# Altium schematic sheet Top.SchDoc
size A4; Organization: TESLA Motors, INC; Address1: 3500 Deer Creek Road; Address2: Palo Alto, CA; Address4: U.S.A.; SheetNumber: 1; SheetTotal: 4
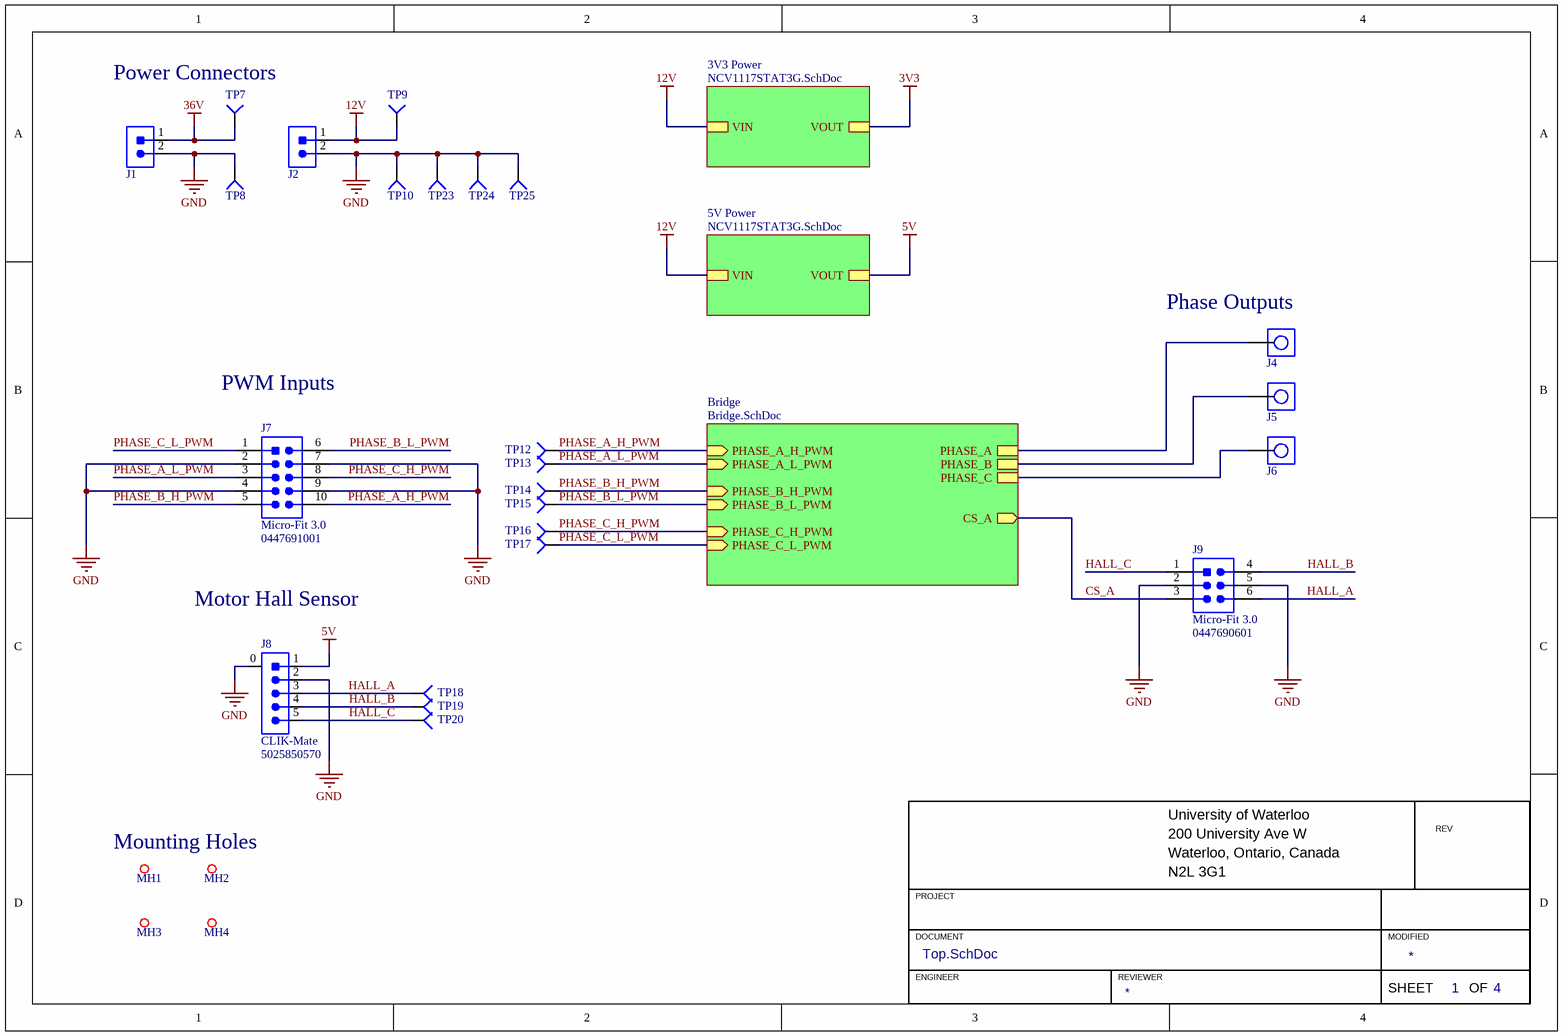
[diagram p0: Top.SchDoc]

## Parts
J1  CON_2POS_XT90  [XT90]  (value not drawn)
J2  CON_2POS_XT60  [XT60]  (value not drawn)
J4  CT3151SP-4  [CALTEST_BANANA_JACK_YELLOW]  (value not drawn)
J5  CT3151SP-5  [CALTEST_BANANA_JACK_GREEN]  (value not drawn)
J6  CT3151SP-6  [CALTEST_BANANA_JACK_BLUE]  (value not drawn)
J7  Family: Micro-Fit 3.0  [MOLEX-0447691001]  (hidden comment: 0447691001)
J8  Family: CLIK-Mate  Manufacturer Part Number 1: 5025850570  [MOLEX-5025850570]  (hidden comment: CON_5M_SM_RA)
J9  Family: Micro-Fit 3.0  [MOLEX-0447690601]  (hidden comment: 0447690601)
MH1  MOUNTING_HOLE_M3  [MOUNTING_HOLE_3mm]  (value not drawn)  (no BOM)
MH2  MOUNTING_HOLE_M3  [MOUNTING_HOLE_3mm]  (value not drawn)  (no BOM)
MH3  MOUNTING_HOLE_M3  [MOUNTING_HOLE_3mm]  (value not drawn)  (no BOM)
MH4  MOUNTING_HOLE_M3  [MOUNTING_HOLE_3mm]  (value not drawn)  (no BOM)
TP7  TESTPOINT_SMD_LOOP  [S1751-46R]  (value not drawn)
TP8  TESTPOINT_SMD_LOOP  [S1751-46R]  (value not drawn)
TP9  TESTPOINT_SMD_LOOP  [S1751-46R]  (value not drawn)
TP10  TESTPOINT_SMD_LOOP  [S1751-46R]  (value not drawn)
TP12  TESTPOINT_1MM_CIRCLE  [TESTPOINT_CIRCLE_1MM]  (value not drawn)  (no BOM)
TP13  TESTPOINT_1MM_CIRCLE  [TESTPOINT_CIRCLE_1MM]  (value not drawn)  (no BOM)
TP14  TESTPOINT_1MM_CIRCLE  [TESTPOINT_CIRCLE_1MM]  (value not drawn)  (no BOM)
TP15  TESTPOINT_1MM_CIRCLE  [TESTPOINT_CIRCLE_1MM]  (value not drawn)  (no BOM)
TP16  TESTPOINT_1MM_CIRCLE  [TESTPOINT_CIRCLE_1MM]  (value not drawn)  (no BOM)
TP17  TESTPOINT_1MM_CIRCLE  [TESTPOINT_CIRCLE_1MM]  (value not drawn)  (no BOM)
TP18  TESTPOINT_1MM_CIRCLE  [TESTPOINT_CIRCLE_1MM]  (value not drawn)  (no BOM)
TP19  TESTPOINT_1MM_CIRCLE  [TESTPOINT_CIRCLE_1MM]  (value not drawn)  (no BOM)
TP20  TESTPOINT_1MM_CIRCLE  [TESTPOINT_CIRCLE_1MM]  (value not drawn)  (no BOM)
TP23  TESTPOINT_SMD_LOOP  [S1751-46R]  (value not drawn)
TP24  TESTPOINT_SMD_LOOP  [S1751-46R]  (value not drawn)
TP25  TESTPOINT_SMD_LOOP  [S1751-46R]  (value not drawn)

## Sub-sheets
3V3 Power = NCV1117STAT3G.SchDoc: VIN, VOUT
5V Power = NCV1117STAT3G.SchDoc: VIN, VOUT
Bridge = Bridge.SchDoc: PHASE_A_H_PWM (in), PHASE_A_L_PWM (in), PHASE_B_H_PWM (in), PHASE_B_L_PWM (in), PHASE_C_H_PWM (in), PHASE_C_L_PWM (in), CS_A (out), PHASE_A, PHASE_B, PHASE_C

## Nets
3V3: sheet 3V3 Power/VOUT
5V: J8.1 ; sheet 5V Power/VOUT
12V: J2.1 TP9.1(=value) ; sheet 3V3 Power/VIN, sheet 5V Power/VIN
36V: J1.1 TP7.1(=value)
GND: J1.2 J2.2 J7.2 J7.4 J7.7 J7.9 J8.0 J8.2 J9.2 J9.5 TP8.1(=value) TP10.1(=value) TP23.1(=value) TP24.1(=value) TP25.1(=value)
CS_A: J9.3 ; sheet Bridge/CS_A
HALL_A: J8.3 J9.6 TP18.1(=value)
HALL_B: J8.4 J9.4 TP19.1(=value)
HALL_C: J8.5 J9.1 TP20.1(=value)
PHASE_A_H_PWM: J7.10 TP12.1(=value) ; sheet Bridge/PHASE_A_H_PWM
PHASE_A_L_PWM: J7.3 TP13.1(=value) ; sheet Bridge/PHASE_A_L_PWM
PHASE_B_H_PWM: J7.5 TP14.1(=value) ; sheet Bridge/PHASE_B_H_PWM
PHASE_B_L_PWM: J7.6 TP15.1(=value) ; sheet Bridge/PHASE_B_L_PWM
PHASE_C_H_PWM: J7.8 TP16.1(=value) ; sheet Bridge/PHASE_C_H_PWM
PHASE_C_L_PWM: J7.1 TP17.1(=value) ; sheet Bridge/PHASE_C_L_PWM
NetJ4_1: J4.1 ; sheet Bridge/PHASE_A
NetJ5_1: J5.1 ; sheet Bridge/PHASE_B
NetJ6_1: J6.1 ; sheet Bridge/PHASE_C

## Notes on the sheet
- (near TP7) Power Connectors
- (near J4) Phase Outputs
- PWM Inputs
- Motor Hall Sensor
- Mounting Holes
- University of Waterloo
- 200 University Ave W
- REV
- PROJECT
- Waterloo, Ontario, Canada
- N2L 3G1
- DOCUMENT
- ENGINEER
- REVIEWER
- MODIFIED
- SHEET
- OF

## Library data of the parts
J1 = CON_2POS_XT90: XT60 CONNECTORS MALE/FEMALE PAIR; Manufacturer 1: DFRobot; Manufacturer Part Number 1: FIT0588; Mounting Type: TH; Package/Footprint: XT90; Supplier 1: Digi-Key; Supplier Part Number 1: 1738-1438-ND
J2 = CON_2POS_XT60: XT60 CONNECTORS MALE/FEMALE PAIR; Manufacturer 1: SparkFun Electronics; Manufacturer Part Number 1: PRT-10474; Mounting Type: TH; Package/Footprint: XT60; Supplier 1: Digi-Key; Supplier Part Number 1: 1568-1816-ND
J4 = CON_BANANA_YELLOW_25A: CONN BANANA JACK SOLDER YELLOW; Manufacturer 1: Cal Test Electronics; Current Rating: 25A; Manufacturer Part Number 1: CT3151SP-4; Supplier 1: Digi-Key; Supplier Part Number 1: BKCT3151SP-4-ND
J5 = CON_BANANA_GREEN_25A: CONN BANANA JACK SOLDER GREEN; Manufacturer 1: Cal Test Electronics; Current Rating: 25A; Manufacturer Part Number 1: CT3151SP-5; Supplier 1: Digi-Key; Supplier Part Number 1: BKCT3151SP-5-ND
J6 = CON_BANANA_BLUE_25A: CONN BANANA JACK SOLDER BLUE; Manufacturer 1: Cal Test Electronics; Current Rating: 25A; Manufacturer Part Number 1: CT3151SP-6; Supplier 1: Digi-Key; Supplier Part Number 1: BKCT3151SP-6-ND
J7 = CON_MOLEX-RCPT_5x2_TH: CONN RCPT 10POS 0.118 TIN PCB; Manufacturer 1: Molex; Voltage Rating: 250VAC; Current Rating: 5A; Pitch: 3mm; Supplier 1: Digi-Key; Supplier Part Number 1: WM1956-ND; Manufacturer Part Number 1: 0447691001
J8 = CON_5M_SM_RA: CONN HEADER SMD RIGHT ANGLE 1.5MM PITCH; Manufacturer 1: Molex; Current Rating: 2A; Supplier 1: Digi-Key; Mounting Type: SMD; Orientation: Right Angle; Supplier Part Number 1: WM14469CT-ND; Package/Footprint: SMD
J9 = CON_MOLEX-RCPT_3x2_TH: CONN RCPT 6POS 0.118 TIN PCB; Manufacturer 1: Molex; Voltage Rating: 250VAC; Current Rating: 5A; Pitch: 3mm; Supplier 1: Digi-Key; Supplier Part Number 1: 23-0447690601-ND; Manufacturer Part Number 1: 0447690601
TP7-TP10 TP23-TP25 = TESTPOINT_SMD_LOOP: TESTPOINT SMD LOOP; Manufacturer 1: Harwin; Supplier 1: Digi-Key; Manufacturer Part Number 1: S1751-46R; Mounting Type: SMD; Package/Footprint: SMD; Supplier Part Number 1: 952-1478-1-ND
TP12-TP20 = TESTPOINT_1MM_CIRCLE: TESTPOINT 1MM CIRCLE